# Altium schematic sheet ESP32Schematic[1].SchDoc (part 3 of 3)
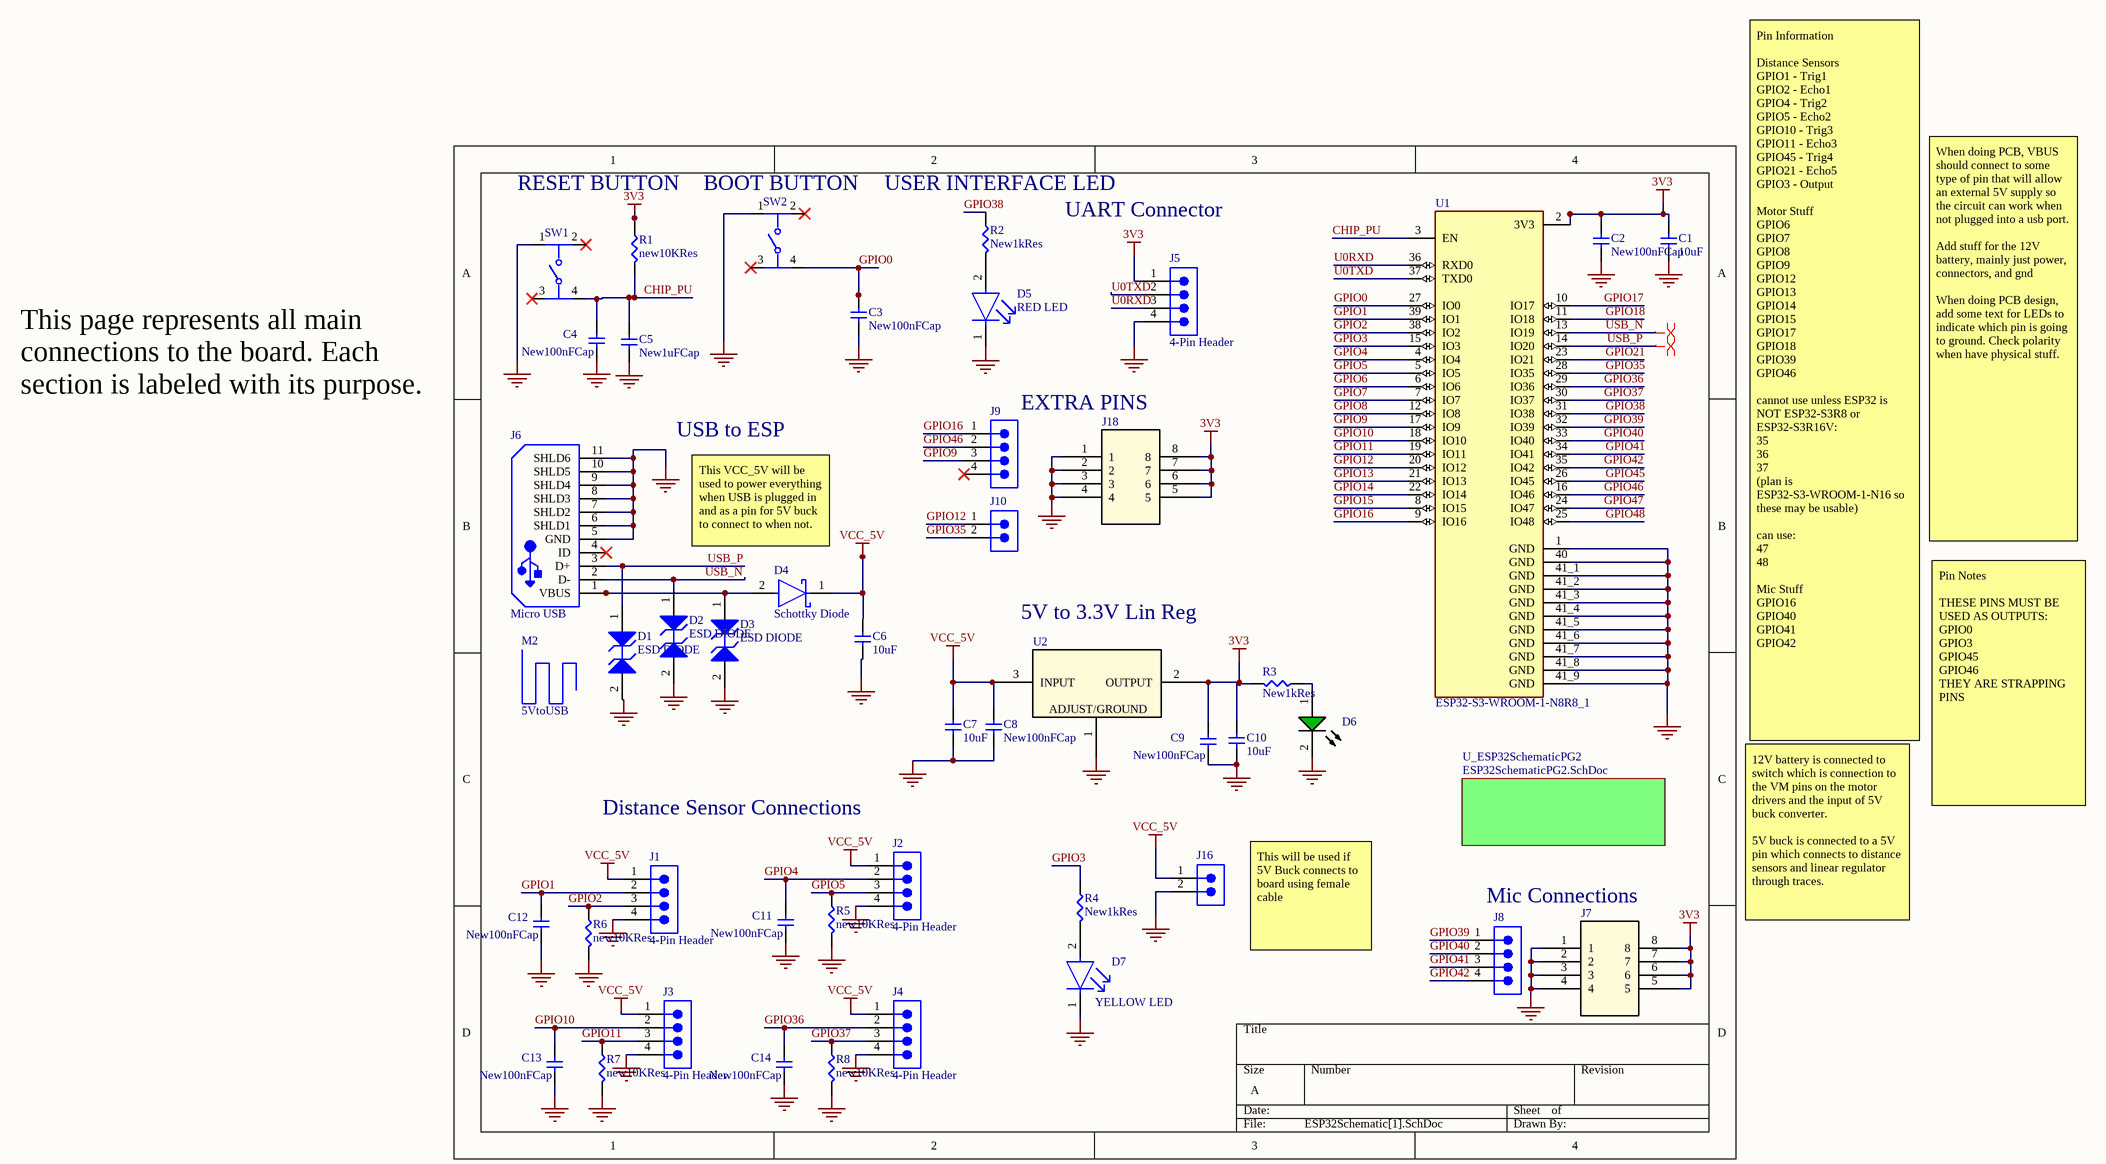
[diagram p2: ESP32Schematic[1].SchDoc]

## Library data of the parts (continued)
J1-J5 J8 J9 = 61300411121: Conn Unshrouded Header HDR 4 POS 2.54mm Solder ST Thru-Hole Bag; Manufacturer: Wurth Elektronik; Connector Type: Male Pin; Contact Resistance: 20mΩ; Current Rating: 3A; Gender: Male; Insulation Resistance: 1GΩ; Number of Contacts: 4; Operating Supply Voltage: 250V; Supplier: DigiKey; Supplier Part Number: 732-5317-ND; Manufacturer Part Number: 61300411121; RoHS: Compliant; Category: Headers and Wire Housings; Stock: 56227; Pricing: 1=0.17, 10=0.147, 25=0.1216, 50=0.1018, 100=0.0918, 1000=0.085 (USD); Color: Black; Contact Material: Gold; Contact Mating Length: 5.9944mm; Contact Plating: Gold; Height: 8.89mm; Lead Free: Lead Free; Lead Pitch: 2.54mm; Length: 10.16mm; Max Operating Temperature: 105°C; Min Operating Temperature: -40°C; Mounting Technology: Through Hole; Pins: 4; Number of Positions: 4; Number of Rows: 1; Orientation: Vertical; Packaging: Bulk; Pitch: 2.54mm; Termination: Solder; Voltage Rating: 250V; ComponentLink1URL: https://datasheet.octopart.com:443/61300411121-W%C3%BCrth-Elektronik-datasheet-44382959.pdf?src-supplier=Future+Electronics; ComponentLink1Description: https://datasheet.octopart.com:443/61300411121-W%C3%BCrth-Elektronik-datasheet-44382959.pdf?src-supplier=Future+Electronics; ComponentLink2URL: https://datasheet.octopart.com:443/61300411121-Wurth-Elektronik-datasheet-169474491.pdf?src-supplier=Wurth+Elektronik; ComponentLink2Description: https://datasheet.octopart.com:443/61300411121-Wurth-Elektronik-datasheet-169474491.pdf?src-supplier=Wurth+Elektronik; ComponentLink3URL: https://datasheet.octopart.com:443/61300411121-W%C3%BCrth-Elektronik-datasheet-149524049.pdf?src-supplier=Farnell; ComponentLink3Description: https://datasheet.octopart.com:443/61300411121-W%C3%BCrth-Elektronik-datasheet-149524049.pdf?src-supplier=Farnell; ComponentLink4URL: https://datasheet.octopart.com:443/61300411121-W%C3%BCrth-Elektronik-datasheet-21154836.pdf?src-supplier=element14+APAC; ComponentLink4Description: https://datasheet.octopart.com:443/61300411121-W%C3%BCrth-Elektronik-datasheet-21154836.pdf?src-supplier=element14+APAC
J6 = 10103594-0001LF: Usb Connector, 5 Contact(S), Female, Right Angle, Surface Mount Terminal, Locking, Receptacle; Manufacturer: Amphenol Communications Solutions; Connector Type: Receptacle, USB; Contact Resistance: 10mΩ; Current Rating: 1.8A; Dielectric Material: Polyethylene; Insulation Resistance: 100MΩ; Max Voltage Rating (AC): 100V; Number of Contacts: 5; Number of Ports: 1; Pitch: 650µm; Plating Thickness: 762nm; USB Standard: USB 2.0; Supplier: DigiKey; Supplier Part Number: 609-4050-1-ND; Manufacturer Part Number: 10103594-0001LF; RoHS: Compliant; Category: USB Connectors; Stock: 38409; Pricing: 1=0.75, 10=0.636, 25=0.5956, 50=0.5672, 100=0.5401, 250=0.50628, 500=0.48208 (USD); China RoHS: Compliant; Color: Black; Contact Gender: Female; Contact Material: Gold, Nickel; Contact Plating: Gold; Features: Shielded; Gender: Receptacle; Height: 3.05mm; Housing Material: Thermoplastic; Lead Free: Lead Free; Length: 8.04mm; Lifecycle Status: Production; Max Operating Temperature: 85°C; Min Operating Temperature: -55°C; Mounting Technology: Horizontal, Surface Mount; Pins: 5; Number of Rows: 1; Number of Terminals: 5; Orientation: Right Angle; Radiation Hardening: No; REACH SVHC: Yes; Shell Finish: Tin; Shell Material: Stainless Steel; Terminal Pitch: 650µm; Termination: Solder; Voltage Rating: 100V; ComponentLink1URL: https://datasheet.octopart.com:443/10103594-0001LF-Amphenol-Communications-Solutions-datasheet-11971448.pdf?src-supplier=Electro+Sonic; ComponentLink1Description: https://datasheet.octopart.com:443/10103594-0001LF-Amphenol-Communications-Solutions-datasheet-11971448.pdf?src-supplier=Electro+Sonic; ComponentLink2URL: https://datasheet.octopart.com:443/10103594-0001LF-Amphenol-Communications-Solutions-datasheet-10887844.pdf?src-supplier=TME; ComponentLink2Description: https://datasheet.octopart.com:443/10103594-0001LF-Amphenol-Communications-Solutions-datasheet-10887844.pdf?src-supplier=TME; ComponentLink3URL: https://datasheet.octopart.com:443/10103594-0001LF-Amphenol-Communications-Solutions-datasheet-96019471.pdf?src-supplier=Amphenol+ICC+%2f+FCI; ComponentLink3Description: https://datasheet.octopart.com:443/10103594-0001LF-Amphenol-Communications-Solutions-datasheet-96019471.pdf?src-supplier=Amphenol+ICC+%2f+FCI; ComponentLink4URL: https://datasheet.octopart.com:443/10103594-0001LF-Amphenol-Communications-Solutions-datasheet-13449752.pdf?src-supplier=RS+(Formerly+Allied+Electronics); ComponentLink4Description: https://datasheet.octopart.com:443/10103594-0001LF-Amphenol-Communications-Solutions-datasheet-13449752.pdf?src-supplier=RS+(Formerly+Allied+Electronics)
J7 J18 = TSW-104-07-F-D: Pin Header, Board-to-Board, 2.54 mm, 2 Rows, 8 Contacts, Through Hole, TSW Series; Manufacturer: Samtec; Manufacturer Lifecycle Status: PRODUCTION; Connector Type: Male Pin; Gender: Male; Max Current Rating: 7.6A; Max Voltage Rating (AC): 550V; Number of Contacts: 8; Pitch: 2.54mm; Supplier: DigiKey; Supplier Part Number: SAM8996-ND; Manufacturer Part Number: TSW-104-07-F-D; RoHS: Compliant; Category: Headers and Wire Housings; Stock: 20158; Pricing: 1=0.43, 50=0.37, 100=0.31, 500=0.26, 1000=0.22, 2000=0.19, 5000=0.17, 10000=0.15 (USD); Color: Black; Contact Material: Bronze; Contact Mating Length: 5.842mm; Contact Plating: Gold; Depth: 5.08mm; Housing Color: Black; Housing Material: Polyester; Lead Pitch: 2.54mm; Length: 10.16mm; Lifecycle Status: Production; Max Operating Temperature: 125°C; Min Operating Temperature: -55°C; Mounting Technology: Through Hole; Number of Positions: 8; Number of Rows: 2; Orientation: Straight; Radiation Hardening: No; REACH SVHC: No; Row Spacing: 2.54mm; Termination: Solder; ComponentLink1URL: https://datasheet.octopart.com:443/TSW-104-07-F-D-Samtec-datasheet-97325576.pdf?src-supplier=Sager+Electronics; ComponentLink1Description: https://datasheet.octopart.com:443/TSW-104-07-F-D-Samtec-datasheet-97325576.pdf?src-supplier=Sager+Electronics; ComponentLink2URL: https://datasheet.octopart.com:443/TSW-104-07-F-D-Samtec-datasheet-151455181.pdf?src-supplier=Sager+Electronics; ComponentLink2Description: https://datasheet.octopart.com:443/TSW-104-07-F-D-Samtec-datasheet-151455181.pdf?src-supplier=Sager+Electronics; ComponentLink3URL: https://sigma.octopart.com:443/97325577/technical_drawing/Samtec-TSW-104-07-F-D.pdf?src-supplier=Samtec; ComponentLink3Description: https://sigma.octopart.com:443/97325577/technical_drawing/Samtec-TSW-104-07-F-D.pdf?src-supplier=Samtec; ComponentLink4URL: https://datasheet.octopart.com:443/TSW-104-07-F-D-Samtec-datasheet-136646178.pdf?src-supplier=Master+Electronics; ComponentLink4Description: https://datasheet.octopart.com:443/TSW-104-07-F-D-Samtec-datasheet-136646178.pdf?src-supplier=Master+Electronics; ComponentLink5URL: https://datasheet.octopart.com:443/TSW-104-07-F-D-Samtec-datasheet-182948906.pdf?src-supplier=JRH+Electronics; ComponentLink5Description: https://datasheet.octopart.com:443/TSW-104-07-F-D-Samtec-datasheet-182948906.pdf?src-supplier=JRH+Electronics; ComponentLink6URL: https://datasheet.octopart.com:443/TSW-104-07-F-D-Samtec-datasheet-160657603.pdf?src-supplier=Toby+Electronics; ComponentLink6Description: https://datasheet.octopart.com:443/TSW-104-07-F-D-Samtec-datasheet-160657603.pdf?src-supplier=Toby+Electronics; ComponentLink7URL: https://datasheet.octopart.com:443/TSW-104-07-F-D-Samtec-datasheet-116539033.pdf?src-supplier=Toby+Electronics; ComponentLink7Description: https://datasheet.octopart.com:443/TSW-104-07-F-D-Samtec-datasheet-116539033.pdf?src-supplier=Toby+Electronics; ComponentLink8URL: https://datasheet.octopart.com:443/TSW-104-07-F-D-Samtec-datasheet-116536310.pdf?src-supplier=Toby+Electronics; ComponentLink8Description: https://datasheet.octopart.com:443/TSW-104-07-F-D-Samtec-datasheet-116536310.pdf?src-supplier=Toby+Electronics; ComponentLink9URL: https://datasheet.octopart.com:443/TSW-104-07-F-D-Samtec-datasheet-116615235.pdf?src-supplier=Electro+Sonic; ComponentLink9Description: https://datasheet.octopart.com:443/TSW-104-07-F-D-Samtec-datasheet-116615235.pdf?src-supplier=Electro+Sonic; ComponentLink10URL: https://datasheet.octopart.com/TSW-104-07-F-D-Samtec-datasheet-86818365.pdf; ComponentLink10Description: https://datasheet.octopart.com/TSW-104-07-F-D-Samtec-datasheet-86818365.pdf; ComponentLink11URL: https://datasheet.octopart.com:443/TSW-104-07-F-D-Samtec-datasheet-62107121.pdf?src-supplier=Newark; ComponentLink11Description: https://datasheet.octopart.com:443/TSW-104-07-F-D-Samtec-datasheet-62107121.pdf?src-supplier=Newark; ComponentLink12URL: https://datasheet.octopart.com:443/TSW-104-07-F-D-Samtec-datasheet-11047283.pdf?src-supplier=Newark; ComponentLink12Description: https://datasheet.octopart.com:443/TSW-104-07-F-D-Samtec-datasheet-11047283.pdf?src-supplier=Newark
J10 J16 = 61300211121: WR-PHD Straight Male, PCB Header, Through Hole, 1 Rows, 2 Contacts, 2.54mm Pitch; Manufacturer: Wurth Elektronik; Connector Type: Male Pin; Contact Resistance: 20mΩ; Current Rating: 3A; Insulation Resistance: 1GΩ; Number of Contacts: 2; Operating Supply Voltage: 250V; Supplier: DigiKey; Supplier Part Number: 732-5315-ND; Manufacturer Part Number: 61300211121; RoHS: Compliant; Category: Headers and Wire Housings; Stock: 193921; Pricing: 1=0.12, 10=0.102, 25=0.0848, 50=0.0712, 100=0.0639, 1000=0.06 (USD); Color: Black; Contact Gender: Male; Contact Material: Gold; Contact Mating Length: 5.9944mm; Contact Plating: Gold; Gender: Male; Height: 8.94mm; Housing Material: PBT; Lead Free: Lead Free; Lead Pitch: 2.54mm; Length: 5.08mm; Max Operating Temperature: 105°C; Min Operating Temperature: -40°C; Mounting Technology: Through Hole; Pins: 2; Number of Positions: 2; Number of Rows: 1; Orientation: Vertical; Packaging: Bulk; Pitch: 2.54mm; REACH SVHC: No; Termination: Through Hole; Voltage Rating: 250V; ComponentLink1URL: https://datasheet.octopart.com:443/61300211121-Wurth-Elektronik-datasheet-168684095.pdf?src-supplier=Wurth+Elektronik; ComponentLink1Description: https://datasheet.octopart.com:443/61300211121-Wurth-Elektronik-datasheet-168684095.pdf?src-supplier=Wurth+Elektronik; ComponentLink2URL: https://datasheet.octopart.com:443/61300211121-W%C3%BCrth-Elektronik-datasheet-44382959.pdf?src-supplier=Future+Electronics; ComponentLink2Description: https://datasheet.octopart.com:443/61300211121-W%C3%BCrth-Elektronik-datasheet-44382959.pdf?src-supplier=Future+Electronics; ComponentLink3URL: https://datasheet.octopart.com:443/61300211121-W%C3%BCrth-Elektronik-datasheet-149524045.pdf?src-supplier=Farnell; ComponentLink3Description: https://datasheet.octopart.com:443/61300211121-W%C3%BCrth-Elektronik-datasheet-149524045.pdf?src-supplier=Farnell; ComponentLink4URL: https://datasheet.octopart.com:443/61300211121-W%C3%BCrth-Elektronik-datasheet-21154836.pdf?src-supplier=element14+APAC; ComponentLink4Description: https://datasheet.octopart.com:443/61300211121-W%C3%BCrth-Elektronik-datasheet-21154836.pdf?src-supplier=element14+APAC
M2 = DH-20M50055: Usb Am to Usb Micro, Usb 2.0 - 1; Manufacturer: CviLux; Supplier: DigiKey; Supplier Part Number: 2987-DH-20M50055-ND; Manufacturer Part Number: DH-20M50055; Category: Uncategorized; Stock: 6106; Pricing: 1=1.55, 10=1.317, 25=1.2344, 50=1.1754, 100=1.1193, 250=1.04916, 500=0.99906, 1000=0.95137, 2500=0.89183 (USD)
R1 R5-R8 = RC0805FR-0710KL: Res Thick Film 0805 10K Ohm 1% 0.125W(1/8W) +/-100ppm/C Epoxy Pad SMD T/R; Manufacturer: Yageo Group; Max Power Dissipation: 125mW; Value: 10kΩ; Temperature Coefficient: 100ppm/°C; Voltage Rating: 150V; Supplier: DigiKey; Supplier Part Number: 311-10.0KCRDKR-ND; Manufacturer Part Number: RC0805FR-0710KL; RoHS: Compliant; Category: Chip SMD Resistors; Stock: 992459; Pricing: 1=0.12, 10=0.009, 25=0.0088, 50=0.0082, 100=0.0071 (USD); Case/Package: 0805; Case Code (Imperial): 0805; China RoHS: Non-Compliant; Composition: Thick Film; Depth: 1.25mm; Features: Moisture Resistant; Height: 500µm; Lead Free: Lead Free; Length: 2mm; Lifecycle Status: Production; Max Operating Temperature: 155°C; Military Standard: Not; Min Operating Temperature: -55°C; Mounting Technology: Surface Mount; Pins: 2; Number of Terminals: 2; Number of Terminations: 2; Packaging: Tape and Reel; Power Dissipation: 125mW; Power Rating: 125mW; REACH SVHC: Yes; Schedule B: 8533210045, 8533210045|8533210045|8533210045|8533210045|8533210045|8533210045|8533210045|8533210045|8533210045|8533210045|8533210045|8533210045|8533210045|8533210045|8533210045|8533210045|8533210045|8533210045|8533210045|8533210045|8533210045|8533210045|8533210045|85; Termination: SMD/SMT; Tolerance: 1%; Voltage Rating (AC): 150V; Width: 1.25mm; Working Voltage: 150V; ComponentLink1URL: https://datasheet.octopart.com:443/RC0805FR-0710KL-Yageo-datasheet-175887523.pdf?src-supplier=Newark; ComponentLink1Description: https://datasheet.octopart.com:443/RC0805FR-0710KL-Yageo-datasheet-175887523.pdf?src-supplier=Newark; ComponentLink2URL: https://datasheet.octopart.com:443/RC0805FR-0710KL-Yageo-datasheet-62067350.pdf?src-supplier=Farnell; ComponentLink2Description: https://datasheet.octopart.com:443/RC0805FR-0710KL-Yageo-datasheet-62067350.pdf?src-supplier=Farnell; ComponentLink3URL: https://datasheet.octopart.com:443/RC0805FR-0710KL-Yageo-datasheet-13691069.pdf?src-supplier=Farnell; ComponentLink3Description: https://datasheet.octopart.com:443/RC0805FR-0710KL-Yageo-datasheet-13691069.pdf?src-supplier=Farnell; ComponentLink4URL: https://datasheet.octopart.com:443/RC0805FR-0710KL-Yageo-datasheet-103092701.pdf?src-supplier=Upverter; ComponentLink4Description: https://datasheet.octopart.com:443/RC0805FR-0710KL-Yageo-datasheet-103092701.pdf?src-supplier=Upverter; ComponentLink5URL: https://datasheet.octopart.com:443/RC0805FR-0710KL-Yageo-datasheet-98239111.pdf?src-supplier=Upverter; ComponentLink5Description: https://datasheet.octopart.com:443/RC0805FR-0710KL-Yageo-datasheet-98239111.pdf?src-supplier=Upverter; ComponentLink6URL: https://datasheet.octopart.com:443/RC0805FR-0710KL-Yageo---Phycomp-datasheet-67302840.pdf?src-supplier=Upverter; ComponentLink6Description: https://datasheet.octopart.com:443/RC0805FR-0710KL-Yageo---Phycomp-datasheet-67302840.pdf?src-supplier=Upverter; ComponentLink7URL: https://datasheet.octopart.com:443/RC0805FR-0710KL-Yageo-datasheet-8330313.pdf?src-supplier=element14+APAC; ComponentLink7Description: https://datasheet.octopart.com:443/RC0805FR-0710KL-Yageo-datasheet-8330313.pdf?src-supplier=element14+APAC; ComponentLink8URL: https://datasheet.octopart.com:443/RC0805FR-0710KL-Yageo-datasheet-12592811.pdf?src-supplier=element14+APAC; ComponentLink8Description: https://datasheet.octopart.com:443/RC0805FR-0710KL-Yageo-datasheet-12592811.pdf?src-supplier=element14+APAC; ComponentLink9URL: https://datasheet.octopart.com:443/RC0805FR-0710KL-Yageo-Group-datasheet-190305687.pdf?src-supplier=Future+Electronics; ComponentLink9Description: https://datasheet.octopart.com:443/RC0805FR-0710KL-Yageo-Group-datasheet-190305687.pdf?src-supplier=Future+Electronics; ComponentLink10URL: https://datasheet.octopart.com:443/RC0805FR-0710KL-Yageo-datasheet-164759695.pdf?src-supplier=Future+Electronics; ComponentLink10Description: https://datasheet.octopart.com:443/RC0805FR-0710KL-Yageo-datasheet-164759695.pdf?src-supplier=Future+Electronics; ComponentLink11URL: https://datasheet.octopart.com:443/RC0805FR-0710KL-Yageo-datasheet-15800360.pdf?src-supplier=Future+Electronics; ComponentLink11Description: https://datasheet.octopart.com:443/RC0805FR-0710KL-Yageo-datasheet-15800360.pdf?src-supplier=Future+Electronics; ComponentLink12URL: https://datasheet.octopart.com:443/RC0805FR-0710KL-Yageo-datasheet-8324252.pdf?src-supplier=Future+Electronics; ComponentLink12Description: https://datasheet.octopart.com:443/RC0805FR-0710KL-Yageo-datasheet-8324252.pdf?src-supplier=Future+Electronics; ComponentLink13URL: https://datasheet.octopart.com:443/RC0805FR-0710KL-Yageo-datasheet-79472498.pdf?src-supplier=Megastar; ComponentLink13Description: https://datasheet.octopart.com:443/RC0805FR-0710KL-Yageo-datasheet-79472498.pdf?src-supplier=Megastar; ComponentLink14URL: https://datasheet.octopart.com:443/RC0805FR-0710KL-Yageo-datasheet-27714392.pdf?src-supplier=Seeed+Studio; ComponentLink14Description: https://datasheet.octopart.com:443/RC0805FR-0710KL-Yageo-datasheet-27714392.pdf?src-supplier=Seeed+Studio; ComponentLink15URL: https://datasheet.octopart.com/RC0805FR-0710KL-Yageo-datasheet-73766026.pdf; ComponentLink15Description: https://datasheet.octopart.com/RC0805FR-0710KL-Yageo-datasheet-73766026.pdf; ComponentLink16URL: https://datasheet.octopart.com:443/RC0805FR-0710KL-Yageo-datasheet-118657.pdf?src-supplier=DigiKey; ComponentLink16Description: https://datasheet.octopart.com:443/RC0805FR-0710KL-Yageo-datasheet-118657.pdf?src-supplier=DigiKey; ComponentLink17URL: https://datasheet.octopart.com:443/RC0805FR-0710KL-Yageo-datasheet-502840.pdf?src-supplier=element14; ComponentLink17Description: https://datasheet.octopart.com:443/RC0805FR-0710KL-Yageo-datasheet-502840.pdf?src-supplier=element14; ComponentLink18URL: http://sigma.octopart.com:80/conflict_mineral_statement/Yageo-company-3.pdf?src-supplier=Compliance+Statements; ComponentLink18Description: http://sigma.octopart.com:80/conflict_mineral_statement/Yageo-company-3.pdf?src-supplier=Compliance+Statements; ComponentLink19URL: http://sigma.octopart.com:80/rohs_statement/Yageo-company-2.pdf?src-supplier=Compliance+Statements; ComponentLink19Description: http://sigma.octopart.com:80/rohs_statement/Yageo-company-2.pdf?src-supplier=Compliance+Statements
R2-R4 = RC0805FR-071KL: Yageo RC0805FR-071KL SMD Resistor 0603 1k Ohm ±1% Thick Film; Manufacturer: Yageo Group; Max Power Dissipation: 125mW; Value: 1kΩ; Temperature Coefficient: 100ppm/°C; Voltage Rating: 150V; Supplier: DigiKey; Supplier Part Number: 311-1.00KCRDKR-ND; Manufacturer Part Number: RC0805FR-071KL; RoHS: Compliant; Category: Chip SMD Resistors; Stock: 1641782; Pricing: 1=0.1, 10=0.008, 25=0.0072 (USD); Case/Package: 0805; Case Code (Imperial): 0805; China RoHS: Non-Compliant; Composition: Thick Film; Depth: 1.25mm; Features: Moisture Resistant; Height: 500µm; Lead Free: Lead Free; Length: 2mm; Lifecycle Status: Production; Max Operating Temperature: 155°C; Military Standard: Not; Min Operating Temperature: -55°C; Mounting Technology: Surface Mount; Pins: 2; Number of Terminals: 2; Number of Terminations: 2; Packaging: Tape & Reel; Power Dissipation: 125mW; Power Rating: 125mW; REACH SVHC: Yes; Schedule B: 8533210045, 8533210045|8533210045, 8533210045|8533210045|8533210045, 8533210045|8533210045|8533210045|8533210045; Termination: SMD/SMT; Tolerance: 1%; Voltage Rating (AC): 150V; Voltage Rating (DC): 150V; Width: 1.25mm; Working Voltage: 150V; ComponentLink1URL: https://datasheet.octopart.com:443/RC0805FR-071KL-Yageo-datasheet-175887523.pdf?src-supplier=IHS; ComponentLink1Description: https://datasheet.octopart.com:443/RC0805FR-071KL-Yageo-datasheet-175887523.pdf?src-supplier=IHS; ComponentLink2URL: https://datasheet.octopart.com:443/RC0805FR-071KL-Yageo-datasheet-103092701.pdf?src-supplier=Upverter; ComponentLink2Description: https://datasheet.octopart.com:443/RC0805FR-071KL-Yageo-datasheet-103092701.pdf?src-supplier=Upverter; ComponentLink3URL: https://datasheet.octopart.com:443/RC0805FR-071KL-Yageo-datasheet-8330313.pdf?src-supplier=element14+APAC; ComponentLink3Description: https://datasheet.octopart.com:443/RC0805FR-071KL-Yageo-datasheet-8330313.pdf?src-supplier=element14+APAC; ComponentLink4URL: https://datasheet.octopart.com:443/RC0805FR-071KL-Yageo-datasheet-62067350.pdf?src-supplier=element14+APAC; ComponentLink4Description: https://datasheet.octopart.com:443/RC0805FR-071KL-Yageo-datasheet-62067350.pdf?src-supplier=element14+APAC; ComponentLink5URL: https://datasheet.octopart.com:443/RC0805FR-071KL-Yageo-datasheet-12592811.pdf?src-supplier=element14+APAC; ComponentLink5Description: https://datasheet.octopart.com:443/RC0805FR-071KL-Yageo-datasheet-12592811.pdf?src-supplier=element14+APAC; ComponentLink6URL: https://datasheet.octopart.com:443/RC0805FR-071KL-Yageo-Group-datasheet-190305687.pdf?src-supplier=Newark; ComponentLink6Description: https://datasheet.octopart.com:443/RC0805FR-071KL-Yageo-Group-datasheet-190305687.pdf?src-supplier=Newark; ComponentLink7URL: https://datasheet.octopart.com:443/RC0805FR-071KL-Yageo-Group-datasheet-176638170.pdf?src-supplier=Future+Electronics; ComponentLink7Description: https://datasheet.octopart.com:443/RC0805FR-071KL-Yageo-Group-datasheet-176638170.pdf?src-supplier=Future+Electronics; ComponentLink8URL: https://datasheet.octopart.com:443/RC0805FR-071KL-Yageo-datasheet-164759695.pdf?src-supplier=Future+Electronics; ComponentLink8Description: https://datasheet.octopart.com:443/RC0805FR-071KL-Yageo-datasheet-164759695.pdf?src-supplier=Future+Electronics; ComponentLink9URL: https://datasheet.octopart.com:443/RC0805FR-071KL-Yageo-datasheet-8324252.pdf?src-supplier=Future+Electronics; ComponentLink9Description: https://datasheet.octopart.com:443/RC0805FR-071KL-Yageo-datasheet-8324252.pdf?src-supplier=Future+Electronics; ComponentLink10URL: https://datasheet.octopart.com:443/RC0805FR-071KL-Yageo-datasheet-79472498.pdf?src-supplier=Megastar; ComponentLink10Description: https://datasheet.octopart.com:443/RC0805FR-071KL-Yageo-datasheet-79472498.pdf?src-supplier=Megastar; ComponentLink11URL: https://datasheet.octopart.com/RC0805FR-071KL-Yageo-datasheet-73766026.pdf; ComponentLink11Description: https://datasheet.octopart.com/RC0805FR-071KL-Yageo-datasheet-73766026.pdf; ComponentLink12URL: https://datasheet.octopart.com:443/RC0805FR-071KL-Yageo-datasheet-13691069.pdf?src-supplier=Farnell; ComponentLink12Description: https://datasheet.octopart.com:443/RC0805FR-071KL-Yageo-datasheet-13691069.pdf?src-supplier=Farnell; ComponentLink13URL: https://datasheet.octopart.com:443/RC0805FR-071KL-Yageo-datasheet-118657.pdf?src-supplier=DigiKey; ComponentLink13Description: https://datasheet.octopart.com:443/RC0805FR-071KL-Yageo-datasheet-118657.pdf?src-supplier=DigiKey; ComponentLink14URL: https://datasheet.octopart.com:443/RC0805FR-071KL-Yageo-datasheet-502840.pdf?src-supplier=element14; ComponentLink14Description: https://datasheet.octopart.com:443/RC0805FR-071KL-Yageo-datasheet-502840.pdf?src-supplier=element14; ComponentLink15URL: http://sigma.octopart.com:80/conflict_mineral_statement/Yageo-company-3.pdf?src-supplier=Compliance+Statements; ComponentLink15Description: http://sigma.octopart.com:80/conflict_mineral_statement/Yageo-company-3.pdf?src-supplier=Compliance+Statements; ComponentLink16URL: http://sigma.octopart.com:80/rohs_statement/Yageo-company-2.pdf?src-supplier=Compliance+Statements; ComponentLink16Description: http://sigma.octopart.com:80/rohs_statement/Yageo-company-2.pdf?src-supplier=Compliance+Statements
SW1 SW2 = PTS647SM38SMTR2LFS: Switch Tactile OFF Mom SPST Round Button Gull Wing 50mA 12VDC 100000Cycles 1.77N Surface Mount T/R; Manufacturer: C&K Components; Contact Resistance: 100mΩ; Electrical Life: 100kcycles; Max Voltage Rating (DC): 12V; Number of Positions: 1; Operating Force: 2.26N; Supplier: DigiKey; Supplier Part Number: 108-PTS647SM38SMTR2LFSCT-ND; Manufacturer Part Number: PTS647SM38SMTR2LFS; RoHS: Compliant; Category: Tactile Switches; Stock: 37562; Pricing: 1=0.26, 10=0.226, 25=0.2116, 100=0.1897, 250=0.17588, 500=0.16596, 1000=0.15666 (USD); Contact Current Rating: 50mA; Height: 2.9mm; Insulation Resistance: 100MΩ; Length: 4.5mm; Life (Cycles): 100kcycles; Lifecycle Status: Production; Max Current Rating: 50mA; Max Operating Temperature: 70°C; Min Operating Temperature: -40°C; Mounting Technology: Surface Mount; REACH SVHC: Yes; Schedule B: 8536509065, 8536509065|8536509065, 8536509065|8536509065|8536509065, 8536509065|8536509065|8536509065|8536509065; Throw Configuration: SPST; Voltage Rating (DC): 12V; ComponentLink1URL: https://datasheet.octopart.com:443/PTS647SM38SMTR2LFS-C%26K-Components-datasheet-180017464.pdf?src-supplier=IHS; ComponentLink1Description: https://datasheet.octopart.com:443/PTS647SM38SMTR2LFS-C%26K-Components-datasheet-180017464.pdf?src-supplier=IHS; ComponentLink2URL: https://datasheet.octopart.com:443/PTS647SM38SMTR2LFS-C%26K-Components-datasheet-117317067.pdf?src-supplier=Future+Electronics; ComponentLink2Description: https://datasheet.octopart.com:443/PTS647SM38SMTR2LFS-C%26K-Components-datasheet-117317067.pdf?src-supplier=Future+Electronics; ComponentLink3URL: https://datasheet.octopart.com:443/PTS647SM38SMTR2-LFS-C%26K-Components-datasheet-175422368.pdf?src-supplier=Farnell; ComponentLink3Description: https://datasheet.octopart.com:443/PTS647SM38SMTR2-LFS-C%26K-Components-datasheet-175422368.pdf?src-supplier=Farnell; ComponentLink4URL: https://datasheet.octopart.com:443/PTS647SM38SMTR2LFS-C%26K-Components-datasheet-145017121.pdf?src-supplier=Electro+Sonic; ComponentLink4Description: https://datasheet.octopart.com:443/PTS647SM38SMTR2LFS-C%26K-Components-datasheet-145017121.pdf?src-supplier=Electro+Sonic; ComponentLink5URL: https://datasheet.octopart.com:443/PTS-647-SM38-SMTR2-LFS-C%26K-Components-datasheet-119449707.pdf?src-supplier=RS+(Formerly+Allied+Electronics); ComponentLink5Description: https://datasheet.octopart.com:443/PTS-647-SM38-SMTR2-LFS-C%26K-Components-datasheet-119449707.pdf?src-supplier=RS+(Formerly+Allied+Electronics)
U1 = ESP32-S3-WROOM-1-N8R8_1: SMD module, ESP32-S3R8 with 8 MB Octal PSRAM die inside, 8 MB Quad SPI flash, P; MF: Espressif Systems; Max Supply Voltage: 3.6V; Min Supply Voltage: 3V; Operating Supply Voltage: 3.3V; Package: None; Price: None; Check_prices: https://www.snapeda.com/parts/ESP32-S3-WROOM-1-N8R8/Espressif+Systems/view-part/?ref=eda; Value: *; SnapEDA_Link: https://www.snapeda.com/parts/ESP32-S3-WROOM-1-N8R8/Espressif+Systems/view-part/?ref=snap; MP: ESP32-S3-WROOM-1-N8R8; Availability: In Stock; Purchase-URL: https://pricing.snapeda.com/search?q=ESP32-S3-WROOM-1-N8R8&ref=eda; Supplier: DigiKey; Supplier Part Number: 5407-ESP32-S3-WROOM-1-N8R8DKR-ND; Manufacturer: Espressif Systems; Manufacturer Part Number: ESP32-S3-WROOM-1-N8R8; RoHS: Compliant; Category: RF Transceiver Modules and Modems; Stock: 8462; Pricing: 1=6.13, 10=5.313, 25=5.0276, 100=4.635, 250=4.39984 (USD); Height - Seated (Max): 3.25mm; Length: 25.5mm; Max Operating Temperature: 65°C; Min Operating Temperature: -40°C; Number of Terminals: 41; REACH SVHC: Yes; Terminal Pitch: 1.27mm; Width: 18mm; ComponentLink1URL: https://datasheet.octopart.com:443/ESP32-S3-WROOM-1-N8R8-Espressif-Systems-datasheet-165560563.pdf?src-supplier=IHS; ComponentLink1Description: https://datasheet.octopart.com:443/ESP32-S3-WROOM-1-N8R8-Espressif-Systems-datasheet-165560563.pdf?src-supplier=IHS; ComponentLink2URL: https://datasheet.octopart.com:443/ESP32-S3-WROOM-1-N8R8-Espressif-Systems-datasheet-175575506.pdf?src-supplier=SOS+electronic; ComponentLink2Description: https://datasheet.octopart.com:443/ESP32-S3-WROOM-1-N8R8-Espressif-Systems-datasheet-175575506.pdf?src-supplier=SOS+electronic; ComponentLink3URL: https://datasheet.octopart.com:443/ESP32-S3-WROOM-1-N8R8-Espressif-Systems-datasheet-164663773.pdf?src-supplier=SOS+electronic; ComponentLink3Description: https://datasheet.octopart.com:443/ESP32-S3-WROOM-1-N8R8-Espressif-Systems-datasheet-164663773.pdf?src-supplier=SOS+electronic; ComponentLink4URL: https://datasheet.octopart.com:443/ESP32-S3-WROOM-1-N8R8-Espressif-Systems-datasheet-188867343.pdf?src-supplier=TME; ComponentLink4Description: https://datasheet.octopart.com:443/ESP32-S3-WROOM-1-N8R8-Espressif-Systems-datasheet-188867343.pdf?src-supplier=TME; ComponentLink5URL: https://datasheet.octopart.com:443/ESP32-S3-WROOM-1-N8R8-Espressif-Systems-datasheet-165560559.pdf?src-supplier=TME; ComponentLink5Description: https://datasheet.octopart.com:443/ESP32-S3-WROOM-1-N8R8-Espressif-Systems-datasheet-165560559.pdf?src-supplier=TME; Supplier 1: DigiKey; Supplier Part Number 1: 5407-ESP32-S3-WROOM-1-N8R8CT-ND
U2 = LM1117MPX-33NOPB: 800-mA 15-V linear voltage regulator 800-mA 15-V linear voltage regulator; Manufacturer: onsemi; Manufacturer Lifecycle Status: ACTIVE; Accuracy: 1%; Dropout Voltage: 1.07V; Max Supply Voltage: 15V; Max Junction Temperature (Tj): 150°C; Min Input Voltage: 4.75V; Number of Channels: 1; Output Current: 800mA; Output Voltage: 3.3V; Voltage Tolerance: 2%; Supplier: DigiKey; Supplier Part Number: 488-LM1117MPX-33NOPBDKR-ND; Manufacturer Part Number: LM1117MPX-33NOPB; RoHS: Compliant; Category: LDO Voltage Regulators; Stock: 7642; Pricing: 1=0.57, 10=0.4, 25=0.3576, 100=0.3116, 250=0.28964, 500=0.27638, 1000=0.26546 (USD); Ambient Temperature Range High: 125°C; Case/Package: SOT-223; China RoHS: Compliant; Height: 1.8mm; Height - Seated (Max): 1.8mm; Length: 6.5mm; Lifecycle Status: Production; Max Operating Temperature: 125°C; Min Operating Temperature: 0°C; Number of Circuits: 1; Number of Outputs: 1; Number of Terminals: 4; REACH SVHC: Yes; Terminal Pitch: 2.3mm; Width: 3.5mm; ComponentLink1URL: https://datasheet.octopart.com:443/LM1117MPX-33NOPB-onsemi-datasheet-164331219.pdf?src-supplier=Upverter; ComponentLink1Description: https://datasheet.octopart.com:443/LM1117MPX-33NOPB-onsemi-datasheet-164331219.pdf?src-supplier=Upverter; ComponentLink2URL: https://sigma.octopart.com:443/138897734/technical_drawing/onsemi-LM1117MPX-33NOPB.pdf?src-supplier=Upverter; ComponentLink2Description: https://sigma.octopart.com:443/138897734/technical_drawing/onsemi-LM1117MPX-33NOPB.pdf?src-supplier=Upverter; ComponentLink3URL: https://datasheet.octopart.com:443/LM1117MPX-33NOPB-ON-Semiconductor-datasheet-141931467.pdf?src-supplier=JRH+Electronics; ComponentLink3Description: https://datasheet.octopart.com:443/LM1117MPX-33NOPB-ON-Semiconductor-datasheet-141931467.pdf?src-supplier=JRH+Electronics; ComponentLink4URL: https://datasheet.octopart.com:443/LM1117MPX-33NOPB-onsemi-datasheet-180961324.pdf?src-supplier=IHS; ComponentLink4Description: https://datasheet.octopart.com:443/LM1117MPX-33NOPB-onsemi-datasheet-180961324.pdf?src-supplier=IHS; ComponentLink5URL: https://datasheet.octopart.com:443/LM1117MPX-33NOPB-onsemi-datasheet-168933395.pdf?src-supplier=Future+Electronics; ComponentLink5Description: https://datasheet.octopart.com:443/LM1117MPX-33NOPB-onsemi-datasheet-168933395.pdf?src-supplier=Future+Electronics; ComponentLink6URL: http://sigma.octopart.com:80/reach_statement/ON-Semiconductor-company-79.pdf?src-supplier=Compliance+Statements; ComponentLink6Description: http://sigma.octopart.com:80/reach_statement/ON-Semiconductor-company-79.pdf?src-supplier=Compliance+Statements; ComponentLink7URL: https://octopart.com:443/opatz8j6/c1?t=Iw_9X4aOcrUl-cPA66dx16ukuJxMweABa0km8qscBKXSU1vYCRq_e4FXJATwxyh124XiaTPtNJ3B9yRxDq_EhavdUU79idWvw_QVFCQ2fS5CQqS4hTb1ifBnFTR-Su749rPEe84Onex6ks4rk9ucP4YVcK4nPzU0XZG6GDKd_pBht-2jM3AE4nGkwXEe6Ksn9x1m2VuOf8AcrWjARzJEmpW0n5uUxMgVrQJ7fVm_XNdLbK-fij8J55BUuF-vYILHBnvsIretFbyyyfqB2jts5YEtD5ypze82yLluaey9lD5qNXSO72sWgsX8XjPSqf-JEzZbFkY95Oi87kzI9m6odTwj0wO7px43NJiKE00YhpVnv7QYBQ&src-supplier=Compliance+Statements; ComponentLink7Description: https://octopart.com:443/opatz8j6/c1?t=Iw_9X4aOcrUl-cPA66dx16ukuJxMweABa0km8qscBKXSU1vYCRq_e4FXJATwxyh124XiaTPtNJ3B9yRxDq_EhavdUU79idWvw_QVFCQ2fS5CQqS4hTb1ifBnFTR-Su749rPEe84Onex6ks4rk9ucP4YVcK4nPzU0XZG6GDKd_pBht-2jM3AE4nGkwXEe6Ksn9x1m2VuOf8AcrWjARzJEmpW0n5uUxMgVrQJ7fVm_XNdLbK-fij8J55BUuF-vYILHBnvsIretFbyyyfqB2jts5YEtD5ypze82yLluaey9lD5qNXSO72sWgsX8XjPSqf-JEzZbFkY95Oi87kzI9m6odTwj0wO7px43NJiKE00YhpVnv7QYBQ&src-supplier=Compliance+Statements